# EAGLE design kilo (EAGLE 9.1.3)

## Sheet 1 of 2
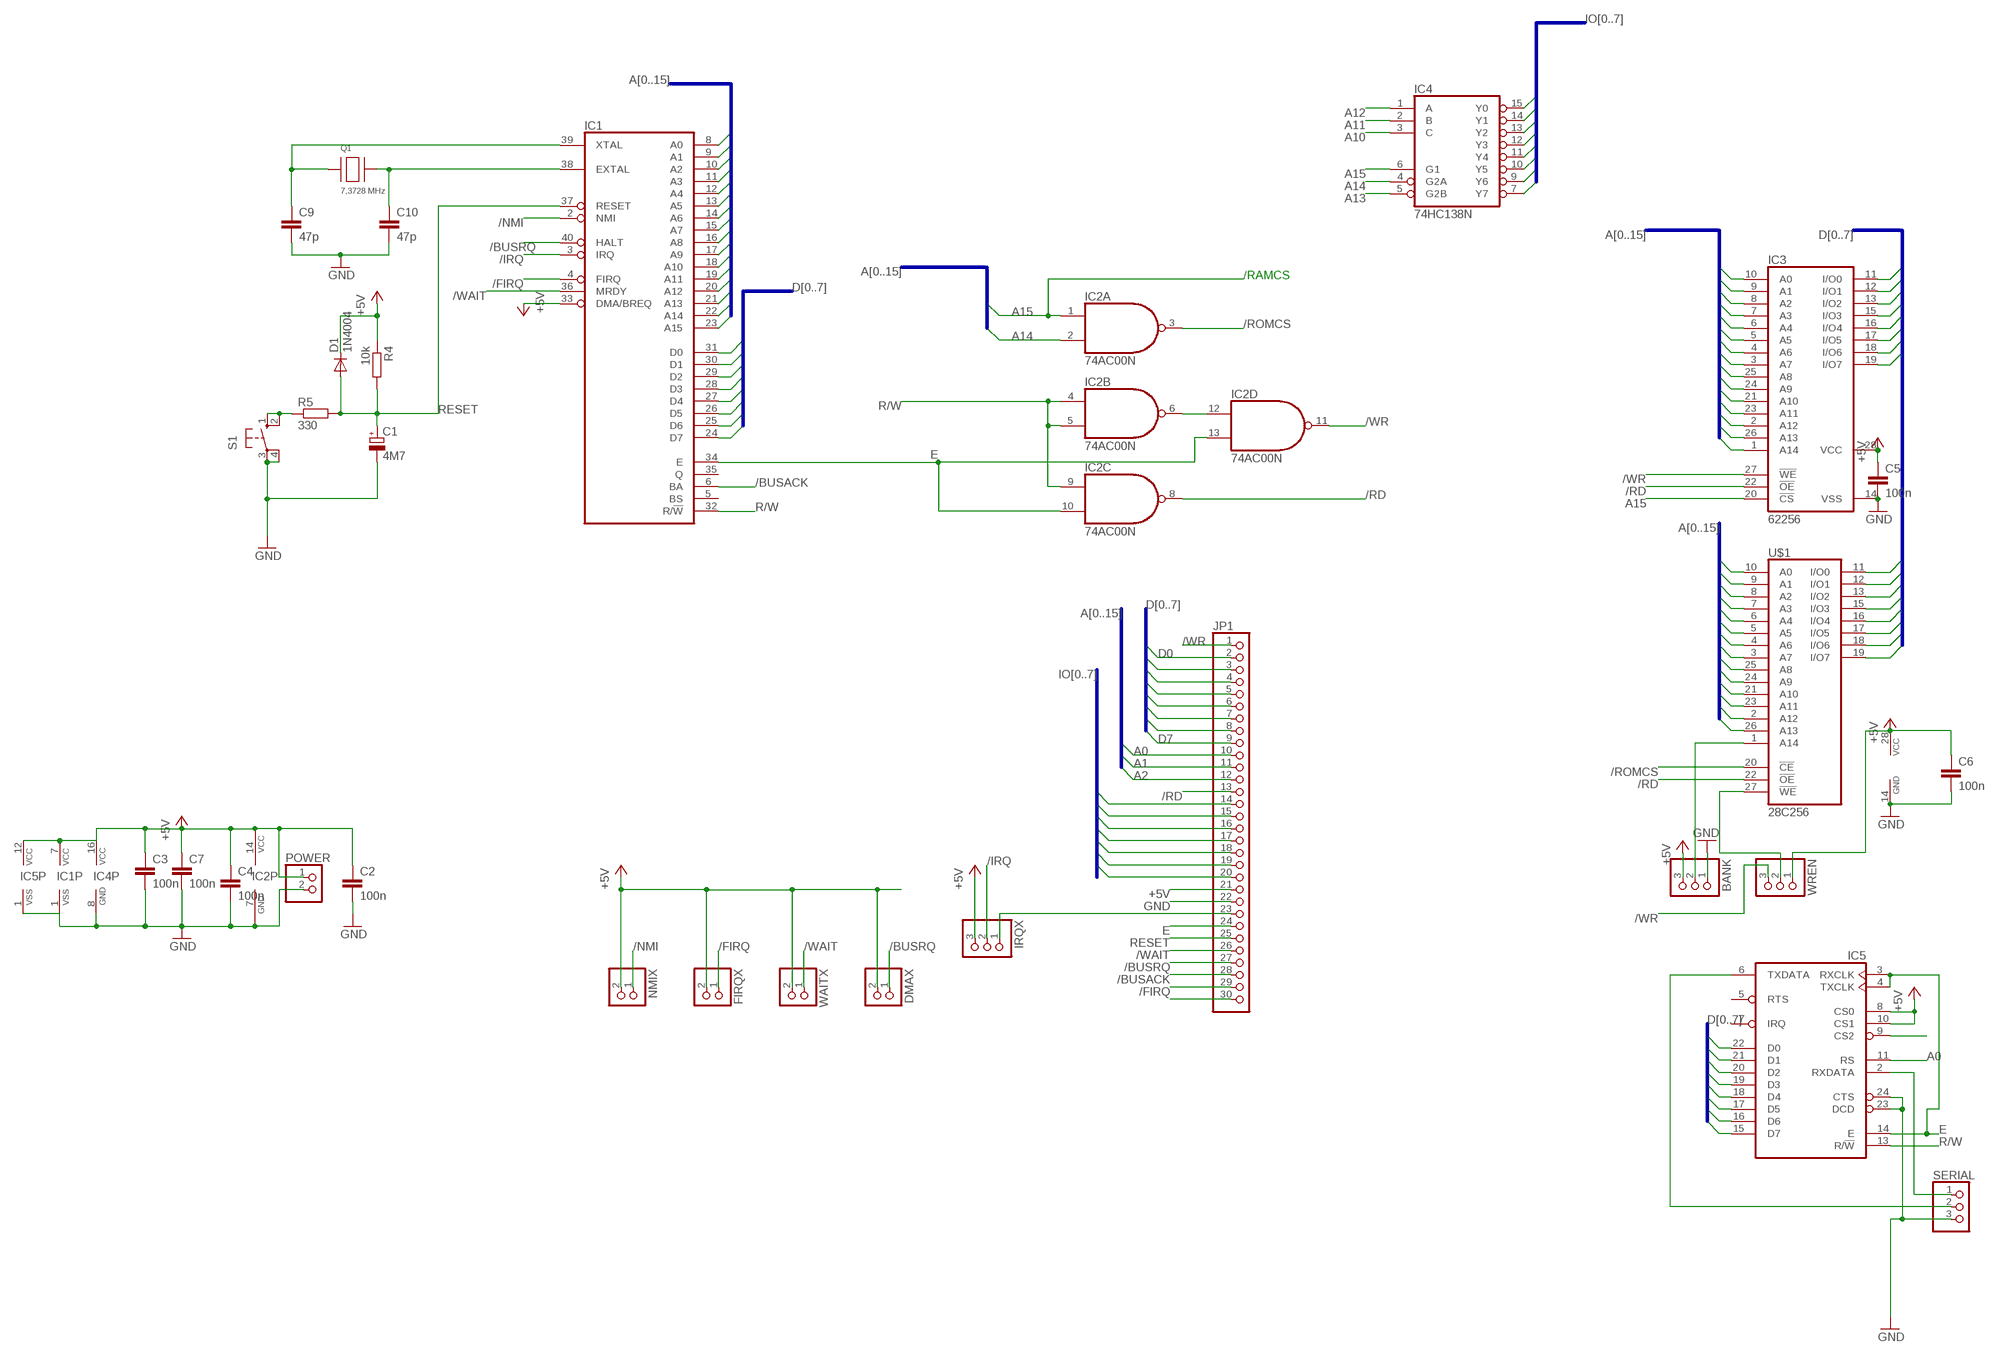
[diagram p0: schematic, sheet 1]

### Parts
BANK  PINHD-1X3  [1X03]
C1  4M7  CPOL-EUE2.5-6  [E2,5-6]
C2  100n  C-EU025-030X050  [C025-030X050]
C3  100n  C-EU025-030X050  [C025-030X050]
C4  100n  C-EU025-030X050  [C025-030X050]
C5  100n  C-EU025-030X050  [C025-030X050]
C6  100n  C-EU025-030X050  [C025-030X050]
C7  100n  C-EU025-030X050  [C025-030X050]
C9  47p  C-EU025-030X050  [C025-030X050]
C10  47p  C-EU025-030X050  [C025-030X050]
D1  1N4004  [DO41-10]
DMAX  PINHD-1X2  [1X02]
FIRQX  PINHD-1X2  [1X02]
IC1  6809  [DIL40]
IC2  74AC00N  74ALS00N  [DIL14]
IC3  62256  62256P  [DIL28-6]
IC4  74HC138N  [DIL16]
IC5  6850  [DIL24]
IRQX  PINHD-1X3  [1X03]
JP1  PINHD-1X30  [1X30]
NMIX  PINHD-1X2  [1X02]
POWER  PINHD-1X2  [1X02]
Q1  7,3728 MHz  306010080_XTAL_8MHZ_HC49US  [HC49US]
R4  10k  R-EU_0207/7  [0207/7]
R5  330  R-EU_0207/7  [0207/7]
S1  40-XX  [B3F-40XX]
SERIAL  PINHD-1X3  [1X03]
U$1  28C256  [DIL28]
WAITX  PINHD-1X2  [1X02]
WREN  PINHD-1X3  [1X03]

### Nets
+5V [supply]: BANK.3 C2.1 C3.1 C4.1 C5.1 C6.1 C7.1 D1.C DMAX.2 FIRQX.2 IC1.7(VCC) IC1.33(DMA/BREQ) IC2.14(P:VCC) IC3.28(VCC) IC4.16(VCC) IC5.8(CS0) IC5.10(CS1) IC5.12(VCC) IRQX.3 JP1.21 NMIX.2 POWER.1 R4.1 U$1.28(VCC) WAITX.2 WREN.1
/BUSACK: IC1.6(BA) JP1.28
/BUSRQ: DMAX.1 IC1.40(HALT) JP1.27
/FIRQ: FIRQX.1 IC1.4(FIRQ) JP1.29
/IRQ: IC1.3(IRQ) IRQX.2
/NMI: IC1.2(NMI) NMIX.1
/RD: IC2.8(C:O) IC3.22(!OE) JP1.13 U$1.22(!OE)
/ROMCS: IC2.3(A:O) U$1.20(!CE)
/WAIT: IC1.36(MRDY) JP1.26 WAITX.1
/WR: IC2.11(D:O) IC3.27(!WE) JP1.1 WREN.3
A0: IC1.8(A0) IC3.10(A0) IC5.11(RS) JP1.10 U$1.10(A0)
A1: IC1.9(A1) IC3.9(A1) JP1.11 U$1.9(A1)
A2: IC1.10(A2) IC3.8(A2) JP1.12 U$1.8(A2)
A3: IC1.11(A3) IC3.7(A3) U$1.7(A3)
A4: IC1.12(A4) IC3.6(A4) U$1.6(A4)
A5: IC1.13(A5) IC3.5(A5) U$1.5(A5)
A6: IC1.14(A6) IC3.4(A6) U$1.4(A6)
A7: IC1.15(A7) IC3.3(A7) U$1.3(A7)
A8: IC1.16(A8) IC3.25(A8) U$1.25(A8)
A9: IC1.17(A9) IC3.24(A9) U$1.24(A9)
A10: IC1.18(A10) IC3.21(A10) IC4.3(C) U$1.21(A10)
A11: IC1.19(A11) IC3.23(A11) IC4.2(B) U$1.23(A11)
A12: IC1.20(A12) IC3.2(A12) IC4.1(A) U$1.2(A12)
A13: IC1.21(A13) IC3.26(A13) IC4.5(G2B) U$1.26(A13)
A14: IC1.22(A14) IC2.2(A:I1) IC3.1(A14) IC4.4(G2A)
A15: IC1.23(A15) IC2.1(A:I0) IC3.20(!CS) IC4.6(G1)
D0: IC1.31(D0) IC3.11(I/O0) IC5.22(D0) JP1.2 U$1.11(I/O0)
D1: IC1.30(D1) IC3.12(I/O1) IC5.21(D1) JP1.3 U$1.12(I/O1)
D2: IC1.29(D2) IC3.13(I/O2) IC5.20(D2) JP1.4 U$1.13(I/O2)
D3: IC1.28(D3) IC3.15(I/O3) IC5.19(D3) JP1.5 U$1.15(I/O3)
D4: IC1.27(D4) IC3.16(I/O4) IC5.18(D4) JP1.6 U$1.16(I/O4)
D5: IC1.26(D5) IC3.17(I/O5) IC5.17(D5) JP1.7 U$1.17(I/O5)
D6: IC1.25(D6) IC3.18(I/O6) IC5.16(D6) JP1.8 U$1.18(I/O6)
D7: IC1.24(D7) IC3.19(I/O7) IC5.15(D7) JP1.9 U$1.19(I/O7)
E: IC1.34(E) IC2.10(C:I1) IC2.13(D:I1) IC5.3(RXCLK) IC5.4(TXCLK) IC5.14(E) JP1.24
GND [supply]: BANK.1 C1.- C2.2 C3.2 C4.2 C5.2 C6.2 C7.2 C9.2 C10.2 IC1.1(VSS) IC2.7(P:GND) IC3.14(VSS) IC4.8(GND) IC5.1(VSS) IC5.23(DCD) IC5.24(CTS) JP1.22 POWER.2 S1.3(P) S1.4(P1) SERIAL.3 U$1.14(GND)
IO0: IC4.15(Y0) IC5.9(CS2)
IO1: IC4.14(Y1) JP1.14
IO2: IC4.13(Y2) JP1.15
IO3: IC4.12(Y3) JP1.16
IO4: IC4.11(Y4) JP1.17
IO5: IC4.10(Y5) JP1.18
IO6: IC4.9(Y6) JP1.19
IO7: IC4.7(Y7) JP1.20
N$1: R5.1 S1.1(S) S1.2(S1)
N$8: JP1.30
N$9: BANK.2 U$1.1(A14)
N$10: IC2.6(B:O) IC2.12(D:I0)
N$31: U$1.27(!WE) WREN.2
N$32: IRQX.1 JP1.23
N$33: C10.1 IC1.38(EXTAL) Q1.P$2
N$35: IC5.2(RXDATA) SERIAL.1
N$36: IC5.6(TXDATA) SERIAL.2
PHI0: C9.1 IC1.39(XTAL) Q1.P$1
R/W: IC1.32(R/!W) IC2.4(B:I0) IC2.5(B:I1) IC2.9(C:I0) IC5.13(R/!W)
RESET: C1.+ D1.A IC1.37(RESET) JP1.25 R4.2 R5.2
Unconnected: IC1.5(BS) IC1.35(Q) IC5.5(RTS) IC5.7(IRQ)

### Buses
A[0..15]
D[0..7]
IO[0..7]

### Notes on the sheet
- /RAMCS

## Sheet 2 of 2

## Library data of the parts
BANK IRQX SERIAL WREN = pinhead:PINHD-1X3: PIN HEADER
C1 = rcl:CPOL-EU: POLARIZED CAPACITOR, European symbol
C2-C7 C9 C10 = rcl:C-EU: CAPACITOR, European symbol
D1 = adafruit:1N4004: DIODE General purpose 1N400x type rectifier (With bigger pads) http://www.ladyada.net/library/pcb/eaglelibrary.html
DMAX FIRQX NMIX POWER WAITX = pinhead:PINHD-1X2: PIN HEADER
IC1 = micro-motorola:6809: MICROCONTROLLER/MEMORY DEVICE; MF: NTE ELECTRONICS; MPN: NTE6809; OC_FARNELL: 4530354; OC_NEWARK: 31C2459
IC2 = 74xx-us:74*00: Quad 2-input NAND gate
IC3 = memory-hitachi:62256P: MEMORY; OC_FARNELL: unknown; OC_NEWARK: unknown
IC4 = 74xx-eu:74*138: 3-line to 8-line DECODER/DEMULTIPLEXER
IC5 = micro-motorola:6850: MICROCONTROLLER/MEMORY DEVICE; MF: NTE ELECTRONICS; MPN: NTE6850; OC_FARNELL: 4899775; OC_NEWARK: 31C2457
JP1 = pinhead:PINHD-1X30: PIN HEADER
Q1 = Seeed-OPL-2017-01-Crystal-Akita:306010080_XTAL_8MHZ_HC49US: HC49/US-11.35X4.65X3.6, DIP Crystal 8MHz-20pF-30ppm-80R, SKU: 306010080
R4 R5 = rcl:R-EU_: RESISTOR, European symbol
S1 = adafruit:40-XX: OMRON SWITCH; MF: OMRON COMPONENTS USA; MPN: B3F-4000; OC_FARNELL: 176434; OC_NEWARK: 36K3105
U$1 = memory:28C256: MEMORY

## Net classes
1 supply: width 0.61 mm

## Board
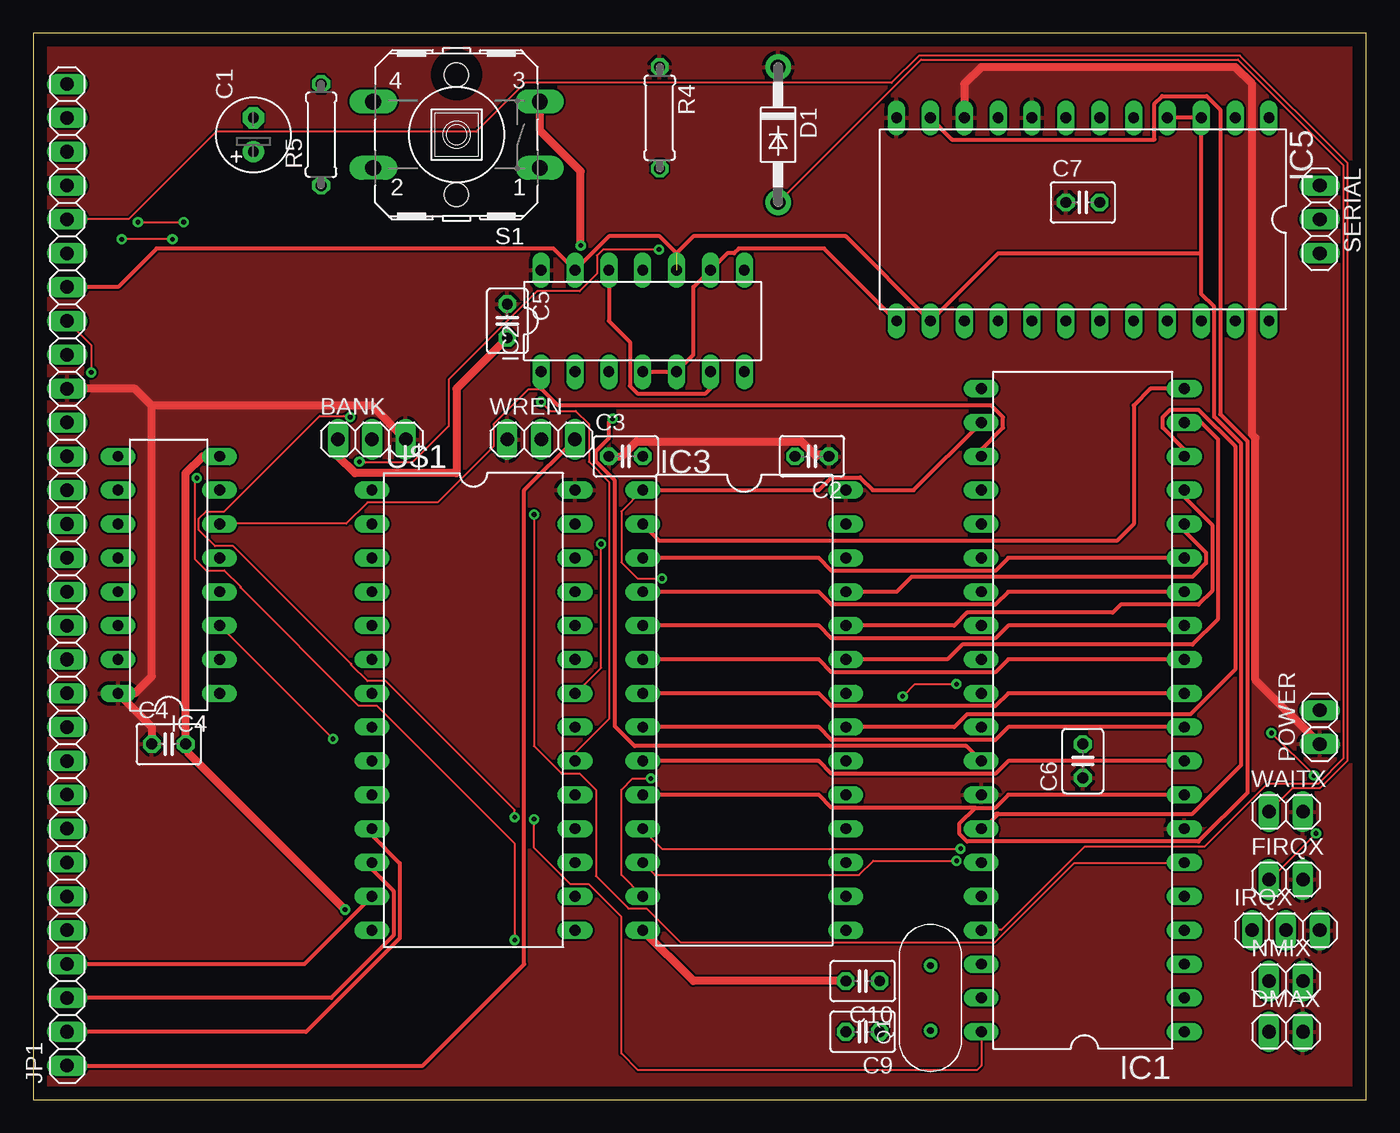
[diagram p1: board, top side]
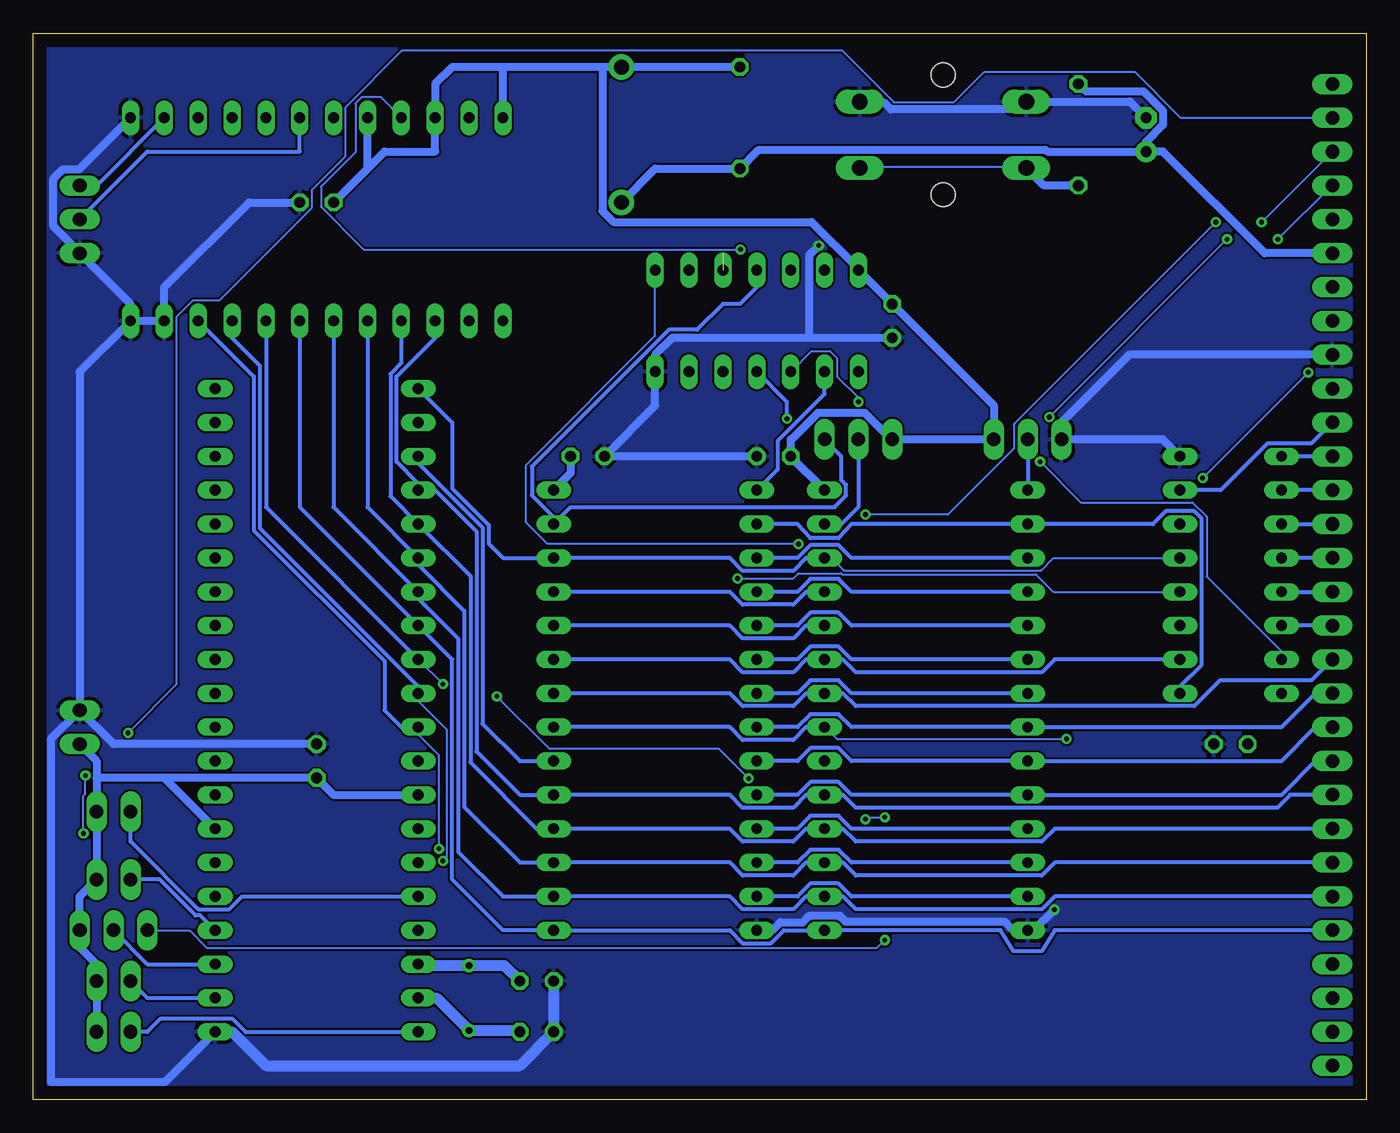
[diagram p2: board, bottom side, seen from below]

Size 100 x 80 mm. Coordinates in mm from the lower left corner, seen from the top.
Outline: 0,0 100,0 100,80 0,80 0,0
Copper layers (1*16): Top 0.035mm / dielectric 1.5mm / Bottom 0.035mm
Design rules "default": minimum track width 6mil, minimum drill 0.35mm, track to track 6mil, track to pad 6mil, pad to pad 6mil, via to via 6mil, smd to smd 6mil, copper to edge 40mil, drill to drill 6mil, minimum pad ring 10mil, minimum via ring 8mil, stop-mask expansion 4mil, vias tented up to drill 0mil, thermal gap 10mil

### Footprints (pad centres in the part's own frame; a part is rotated, then mirrored left to right if it is on the bottom)
1X03 = drill 1.016 long: 1 -2.54,0; 2 0,0; 3 2.54,0
E2,5-6 = drill 0.813 pad 1.6: + -1.27,0 | drill 0.813 pad 1.6 octagon: - 1.27,0
C025-030X050 = drill 0.813 octagon: 1 -1.27,0; 2 1.27,0
DO41-10 = drill 1.118 pad 1.93: A 5.08,0; C -5.08,0
1X02 = drill 1.016 long: 1 -1.27,0; 2 1.27,0
DIL40 = drill 0.813 long: 1 -24.13,-7.62; 2 -21.59,-7.62; 3 -19.05,-7.62; 4 -16.51,-7.62; 5 -13.97,-7.62; 6 -11.43,-7.62; 7 -8.89,-7.62; 8 -6.35,-7.62; 9 -3.81,-7.62; 10 -1.27,-7.62; 11 1.27,-7.62; 12 3.81,-7.62; 13 6.35,-7.62; 14 8.89,-7.62; 15 11.43,-7.62; 16 13.97,-7.62; 17 16.51,-7.62; 18 19.05,-7.62; 19 21.59,-7.62; 20 24.13,-7.62; 21 24.13,7.62; 22 21.59,7.62; 23 19.05,7.62; 24 16.51,7.62; 25 13.97,7.62; 26 11.43,7.62; 27 8.89,7.62; 28 6.35,7.62; 29 3.81,7.62; 30 1.27,7.62; 31 -1.27,7.62; 32 -3.81,7.62; 33 -6.35,7.62; 34 -8.89,7.62; 35 -11.43,7.62; 36 -13.97,7.62; 37 -16.51,7.62; 38 -19.05,7.62; 39 -21.59,7.62; 40 -24.13,7.62
DIL14 = drill 0.813 long: 1 -7.62,-3.81; 2 -5.08,-3.81; 3 -2.54,-3.81; 4 0,-3.81; 5 2.54,-3.81; 6 5.08,-3.81; 7 7.62,-3.81; 8 7.62,3.81; 9 5.08,3.81; 10 2.54,3.81; 11 0,3.81; 12 -2.54,3.81; 13 -5.08,3.81; 14 -7.62,3.81
DIL28-6 = drill 0.813 long: 1 -16.51,-7.62; 2 -13.97,-7.62; 3 -11.43,-7.62; 4 -8.89,-7.62; 5 -6.35,-7.62; 6 -3.81,-7.62; 7 -1.27,-7.62; 8 1.27,-7.62; 9 3.81,-7.62; 10 6.35,-7.62; 11 8.89,-7.62; 12 11.43,-7.62; 13 13.97,-7.62; 14 16.51,-7.62; 15 16.51,7.62; 16 13.97,7.62; 17 11.43,7.62; 18 8.89,7.62; 19 6.35,7.62; 20 3.81,7.62; 21 1.27,7.62; 22 -1.27,7.62; 23 -3.81,7.62; 24 -6.35,7.62; 25 -8.89,7.62; 26 -11.43,7.62; 27 -13.97,7.62; 28 -16.51,7.62
DIL16 = drill 0.813 long: 1 -8.89,-3.81; 2 -6.35,-3.81; 3 -3.81,-3.81; 4 -1.27,-3.81; 5 1.27,-3.81; 6 3.81,-3.81; 7 6.35,-3.81; 8 8.89,-3.81; 9 8.89,3.81; 10 6.35,3.81; 11 3.81,3.81; 12 1.27,3.81; 13 -1.27,3.81; 14 -3.81,3.81; 15 -6.35,3.81; 16 -8.89,3.81
DIL24 = drill 0.813 long: 1 -13.97,-7.62; 2 -11.43,-7.62; 3 -8.89,-7.62; 4 -6.35,-7.62; 5 -3.81,-7.62; 6 -1.27,-7.62; 7 1.27,-7.62; 8 3.81,-7.62; 9 6.35,-7.62; 10 8.89,-7.62; 11 11.43,-7.62; 12 13.97,-7.62; 13 13.97,7.62; 14 11.43,7.62; 15 8.89,7.62; 16 6.35,7.62; 17 3.81,7.62; 18 1.27,7.62; 19 -1.27,7.62; 20 -3.81,7.62; 21 -6.35,7.62; 22 -8.89,7.62; 23 -11.43,7.62; 24 -13.97,7.62
1X30 = drill 1.016 long: 1 -36.83,0; 2 -34.29,0; 3 -31.75,0; 4 -29.21,0; 5 -26.67,0; 6 -24.13,0; 7 -21.59,0; 8 -19.05,0; 9 -16.51,0; 10 -13.97,0; 11 -11.43,0; 12 -8.89,0; 13 -6.35,0; 14 -3.81,0; 15 -1.27,0; 16 1.27,0; 17 3.81,0; 18 6.35,0; 19 8.89,0; 20 11.43,0; 21 13.97,0; 22 16.51,0; 23 19.05,0; 24 21.59,0; 25 24.13,0; 26 26.67,0; 27 29.21,0; 28 31.75,0; 29 34.29,0; 30 36.83,0
HC49US = drill 0.5: P$1 -2.44,0; P$2 2.44,0
0207/7 = drill 0.813 octagon: 1 -3.81,0; 2 3.81,0
B3F-40XX = drill 1.194 long: 1 -6.248,2.489; 2 6.248,2.489; 3 -6.248,-2.489; 4 6.248,-2.489 | hole 1.803: 0,-4.496; 0,4.496
DIL28 = drill 0.813 long: 1 -16.51,-7.62; 2 -13.97,-7.62; 3 -11.43,-7.62; 4 -8.89,-7.62; 5 -6.35,-7.62; 6 -3.81,-7.62; 7 -1.27,-7.62; 8 1.27,-7.62; 9 3.81,-7.62; 10 6.35,-7.62; 11 8.89,-7.62; 12 11.43,-7.62; 13 13.97,-7.62; 14 16.51,-7.62; 15 16.51,7.62; 16 13.97,7.62; 17 11.43,7.62; 18 8.89,7.62; 19 6.35,7.62; 20 3.81,7.62; 21 1.27,7.62; 22 -1.27,7.62; 23 -3.81,7.62; 24 -6.35,7.62; 25 -8.89,7.62; 26 -11.43,7.62; 27 -13.97,7.62; 28 -16.51,7.62

### Placement (x,y rotation side)
BANK  25.4,49.53 0 top
C1  16.51,72.39 90 top
C2  58.42,48.26 180 top
C3  44.45,48.26 0 top
C4  10.16,26.67 0 top
C5  35.56,58.42 270 top
C6  78.74,25.4 90 top
C7  78.74,67.31 0 top
C9  62.23,5.08 180 top
C10  62.23,8.89 180 top
D1  55.88,72.39 270 top
DMAX  93.98,5.08 0 top
FIRQX  93.98,16.51 0 top
IC1  78.74,29.21 90 top
IC2  45.72,58.42 0 top
IC3  53.34,29.21 270 top
IC4  10.16,39.37 90 top
IC5  78.74,66.04 180 top
IRQX  93.98,12.7 0 top
JP1  2.54,39.37 90 top
NMIX  93.98,8.89 0 top
POWER  96.52,27.94 90 top
Q1  67.31,7.62 90 top
R4  46.99,73.66 270 top
R5  21.59,72.39 90 top
S1  31.75,72.39 180 top
SERIAL  96.52,66.04 270 top
U$1  33.02,29.21 270 top
WAITX  93.98,21.59 0 top
WREN  38.1,49.53 0 top

### Tracks (layer width: path | path; a pad name or v marks a point on that pad's centre or on a via)
+5V
  Top 0.61: 8.89,52.07 8.89,31.75 7.62,30.48 IC4.16 8.89,27.94 C4.1 | 8.89,52.07 7.62,53.34 JP1.21 | BANK.3 25.4,52.07 8.89,52.07 | POWER.1 91.69,31.5 91.69,49.65 91.44,49.9 91.44,76.2 90.17,77.47 71.12,77.47 69.85,76.2 IC5.10 | C3.1 44.14,48.26 45.26,49.38 57.61,49.38 58.58,48.41 | 58.58,48.41 58.73,48.26 | 58.58,48.41 59.53,48.41 C2.1
  Bottom 0.61: U$1.28 C3.1 43.18,49.53 43.13,49.53 41.15,51.51 37.59,51.51 35.61,49.53 WREN.1 BANK.3 27.94,52.07 C5.1 IC2.14 38.25,62.48 41.6,65.84 56.46,65.84 57.3,66.67 57.3,77.47 | IC3.28 59.69,46.99 C2.1 | DMAX.2 NMIX.2 95.25,10.16 96.52,11.43 IRQX.3 96.52,15.24 FIRQX.2 WAITX.2 95.25,24.13 | POWER.1 95.25,25.4 95.25,24.13 | 90.17,24.13 C6.1 77.47,22.86 IC1.33 | 90.17,24.13 95.25,24.13 | C7.1 74.93,69.85 | 74.93,69.85 IC5.8 | 74.93,69.85 73.66,71.12 69.85,71.12 IC5.10 69.85,76.2 68.58,77.47 64.77,77.47 | IC1.7 90.17,24.13 | R4.1 D1.C 57.3,77.47 | 57.3,77.47 64.77,77.47 | IC5.12 64.77,77.47
  pour Top: 0,80.01 100.33,80.01 100.33,0 0,0
/BUSACK  (via drill 0.35)
  Top 0.152: v37.57,43.89 37.57,26.52 39.62,24.46 41,24.46 42.22,23.24 42.22,16.76 44.65,14.33 46.02,14.33 48.54,11.81 72.16,11.81 78.11,17.75 86.33,17.75 IC1.6 | v7.85,65.84 v11.28,65.84
  Bottom 0.152: v37.57,43.89 31.39,43.89 26.44,48.84 26.44,50.67 v11.28,65.84 | v7.85,65.84 2.59,71.09 JP1.28
/BUSRQ  (via drill 0.35)
  Top 0.152: v10.44,64.54 v6.63,64.54 | v23.77,51.21 23.39,51.21 23.32,51.28 21.49,51.28 14.33,44.12 12.95,44.12 12.42,43.59 12.42,42.75 13.64,41.53 15.01,41.53 23.85,32.69 23.85,32.61 25.07,31.39 26.44,31.39 36.12,21.72 v36.12,21.18 | v37.57,21.03 37.57,18.9 40.31,16.15 41.68,16.15 44.12,13.72 44.12,3.45 45.36,2.21 70.79,2.21 71.12,2.54 IC1.40
  Bottom 0.152: v6.63,64.54 2.59,68.58 JP1.27 | v23.77,51.21 v10.44,64.54 | v36.12,21.18 37.41,21.18 v37.57,21.03
  Bottom 0.305: IC1.40 84.08,5.08 85.05,6.04 90.47,6.04 91.44,5.08 DMAX.1
/FIRQ  (via drill 0.35)
  Top 0.152: v96.09,24.31 v92.89,27.51 | v96.24,19.96 92.73,16.46 FIRQX.1
  Bottom 0.152: v92.89,27.51 89.23,31.17 89.23,58.75 88.01,59.97 86.03,59.97 79.1,66.9 79.1,68.28 76.58,70.79 76.58,74.45 72.31,78.72 39.32,78.72 35.43,74.83 30.94,74.83 28.65,77.11 17.37,77.11 13.95,73.69 2.59,73.69 JP1.29 | v96.09,24.31 96.09,22.94 96.24,22.78 v96.24,19.96
  Bottom 0.305: IC1.4 87.48,13.82 87.82,13.82 90.51,16.51 FIRQX.1
/IRQ
  Bottom 0.305: IC1.3 91.44,10.16 IRQX.2
/NMI
  Bottom 0.305: IC1.2 91.44,7.62 NMIX.1
/RD  (via drill 0.35)
  Top 0.152: v42.6,41.68 42.6,32.38 40.69,30.48 U$1.22
  Bottom 0.152: IC2.8 53.34,57.3 63.02,47.62 63.02,43.28 61.42,41.68 v42.6,41.68
  Bottom 0.305: IC3.22 47.74,30.48 46.78,29.52 42.98,29.52 42.02,30.48 U$1.22 39.26,30.48 38.3,29.52 12.91,29.52 10.98,31.45 4.12,31.45 JP1.13
/ROMCS  (via drill 0.35)
  Top 0.152: v38.1,52.35 38.79,51.66 40.69,51.66 41.68,50.67 41.68,47.85 43.2,46.33 43.2,28.57 40.69,26.06 40.69,25.45 U$1.20
  Bottom 0.152: v38.1,52.35 38.1,52.65 39.7,54.25 39.7,55.63 40.23,56.16 41.6,56.16 43.13,54.63 IC2.3
/WAIT
  Top 0.152: JP1.26 2.59,66.06 7.16,66.06 13.72,72.62 33.22,72.62 36.88,76.28 64.39,76.28 66.45,78.33 90.53,78.33 98.6,70.26 98.6,25.45 96.55,23.39 94.49,23.39 92.73,21.64 WAITX.1
  Bottom 0.305: IC1.36 84.33,15.24 85.3,14.28 87.63,14.28 92.71,19.36 WAITX.1
/WR
  Top 0.305: JP1.1 29.21,2.54 36.83,10.16 36.83,45.72 WREN.3
  Bottom 0.305: WREN.3 39.37,48.26 39.37,46.48 39.01,46.12 39.01,45.32 39.88,44.45 59.69,44.45 IC3.27 60.96,43.7 62.59,45.32 62.59,47.5 52.32,57.76 50.19,57.76 48.26,59.69 46.99,59.69 45.72,60.96 IC2.11
A0
  Top 0.305: IC1.8 73.14,22.86 72.18,21.89 70.67,21.89 | IC3.10 58.94,22.86 59.9,21.89 70.67,21.89 | IC5.11 68.94,72.03 84.12,72.03 84.12,74.72 84.69,75.29 88.03,75.29 89.05,74.26 89.05,51.43 91.08,49.39 91.08,23.02 87.42,19.36 70.06,19.36 69.49,19.92 69.49,20.72 70.67,21.89
  Bottom 0.305: IC3.10 42.66,22.86 41.7,23.82 39.58,23.82 38.62,22.86 U$1.10 6.35,22.86 3.81,25.4 JP1.10
A1
  Top 0.305: IC1.9 73.14,25.4 72.18,24.43 59.9,24.43 58.94,25.4 IC3.9
  Bottom 0.305: IC3.9 42.66,25.4 41.7,26.36 39.58,26.36 38.62,25.4 U$1.9 6.35,25.4 3.81,27.94 JP1.11
A2
  Top 0.305: IC1.10 73.14,27.94 72.18,26.98 59.9,26.98 58.94,27.94 IC3.8
  Bottom 0.305: IC3.8 42.66,27.94 41.7,28.91 39.58,28.91 38.62,27.94 U$1.8 6.35,27.94 3.81,30.48 JP1.12
A3
  Top 0.305: IC1.11 73.14,30.48 72.18,29.52 59.9,29.52 58.94,30.48 IC3.7
  Bottom 0.305: U$1.7 38.62,30.48 39.58,31.45 41.7,31.45 42.66,30.48 IC3.7
A4
  Top 0.305: IC1.12 73.14,33.02 72.18,32.05 59.9,32.05 58.94,33.02 IC3.6
  Bottom 0.305: U$1.6 38.62,33.02 39.58,33.98 41.7,33.98 42.66,33.02 IC3.6
A5
  Top 0.305: IC1.13 73.14,35.56 72.18,34.59 59.9,34.59 58.94,35.56 IC3.5
  Bottom 0.305: U$1.5 38.62,35.56 39.58,36.52 41.7,36.52 42.66,35.56 IC3.5
A6
  Top 0.305: IC1.14 73.14,38.1 72.18,37.13 59.9,37.13 58.94,38.1 IC3.4
  Bottom 0.305: U$1.4 38.62,38.1 39.58,39.06 41.7,39.06 42.66,38.1 IC3.4
A7
  Top 0.305: IC1.15 73.14,40.64 72.18,39.67 59.9,39.67 58.94,40.64 IC3.3
  Bottom 0.305: U$1.3 38.62,40.64 39.58,41.6 41.7,41.6 42.66,40.64 IC3.3
A8
  Top 0.305: IC1.16 86.36,42.66 87.99,41.04 87.99,40.24 86.96,39.22 65.89,39.22 64.77,38.1 IC3.25
  Bottom 0.305: U$1.25 42.02,38.1 42.98,37.13 46.78,37.13 47.74,38.1 IC3.25
A9
  Top 0.305: IC1.17 86.36,45.2 88.44,43.12 88.44,38.16 87.42,37.13 81.58,37.13 80.97,36.52 70.06,36.52 69.09,35.56 IC3.24
  Bottom 0.305: U$1.24 42.02,35.56 42.98,34.59 46.78,34.59 47.74,35.56 IC3.24
A10  (via drill 0.35)
  Top 0.152: v22.48,27.05 IC4.3
  Top 0.305: IC1.18 86.36,48.77 84.73,50.4 84.73,51.2 85.3,51.77 87.42,51.77 90.17,49.02 90.17,32.27 86.81,28.91 70.06,28.91 69.09,27.94 IC3.21
  Bottom 0.152: v22.48,27.05 39.7,27.05 40.54,27.89 U$1.21
  Bottom 0.305: U$1.21 42.02,27.94 42.98,26.98 46.78,26.98 47.74,27.94 IC3.21
A11
  Top 0.305: IC3.23 68.58,33.02 69.7,34.14 86.96,34.14 88.9,36.08 88.9,49.53 87.63,50.8 IC1.19
  Bottom 0.305: IC3.23 47.74,33.02 46.78,32.05 42.98,32.05 42.02,33.02 U$1.23 39.26,33.02 38.3,32.05 24.34,32.05 23.38,33.02 IC4.2
A12
  Top 0.305: IC3.2 46.99,41.91 81.28,41.91 82.55,43.18 82.55,52.07 83.82,53.34 IC1.20
  Bottom 0.305: IC3.2 42.66,43.18 41.7,42.11 39.58,42.11 38.62,43.18 U$1.2 15.99,43.18 15.03,44.15 12.91,44.15 12.34,43.58 12.34,32.62 13.97,31 IC4.1
A13
  Bottom 0.152: IC4.5 14.02,40.62 23.47,40.62 24.38,39.7 39.17,39.7 40.01,40.54 40.54,40.54 U$1.26
  Bottom 0.305: U$1.26 42.02,40.64 42.98,39.67 46.78,39.67 47.74,40.64 IC3.26 64.77,40.64 65.84,41.71 65.84,43.11 68.58,45.85 68.58,50.8 IC1.21
A14  (via drill 0.35)
  Top 0.152: v47.17,39.09 45.34,39.09 44.12,40.31 44.12,44.12 IC3.1
  Top 0.305: IC1.22 66.04,45.72 62.98,45.72 62.02,46.69 59.9,46.69 58.94,45.72 IC3.1
  Bottom 0.152: IC4.4 23.47,38.1 24.77,39.4 39.32,39.4 39.4,39.47 42.6,39.47 42.98,39.09 v47.17,39.09
  Bottom 0.305: IC3.1 44.15,47.3 44.15,49.43 40.64,52.93 IC2.2
A15
  Top 0.152: IC4.6 14.02,43.2 23.47,43.2 25.07,44.81 30.33,44.81 34.52,49 34.52,50.67 37.11,53.26 38.02,53.26 38.1,53.34
  Top 0.305: IC1.23 71.12,48.77 72.75,50.4 72.75,51.2 71.88,52.07 39.37,52.07 38.1,53.34 IC2.1
  Bottom 0.305: IC1.23 71.12,47.74 66.29,42.92 66.29,28.19 63.5,25.4 IC3.20
D0  (via drill 0.35)
  Top 0.152: v69.57,18.82 47.17,18.82 45.72,20.27 IC3.11
  Top 0.305: U$1.11 25.4,19.8 27.48,17.72 27.48,12.11 20.45,5.08 JP1.2
  Bottom 0.152: v69.57,18.82 69.57,25.83 71.09,27.36 71.09,27.81 IC1.31
  Bottom 0.305: U$1.11 38.62,20.32 39.58,21.29 41.7,21.29 42.66,20.32 IC3.11 | IC5.22 83.46,54.25 83.46,42.69 73.66,32.89 73.66,29.21 72.39,27.94 IC1.31
D1  (via drill 0.35)
  Top 0.152: v69.27,17.91 63.02,17.91 61.95,16.84 46.63,16.84 45.72,17.75 IC3.12
  Top 0.305: U$1.12 25.4,17.27 27.03,15.64 27.03,12.3 22.34,7.62 JP1.3
  Bottom 0.152: v69.27,17.91 68.96,18.21 68.96,27.74 71.02,29.79 71.02,30.4 IC1.30
  Bottom 0.305: U$1.12 38.62,17.78 39.58,18.75 41.7,18.75 42.66,17.78 IC3.12 | IC5.21 85.09,57.15 83.01,55.07 83.01,42.88 71.12,31 IC1.30
D2  (via drill 0.35)
  Top 0.152: v69.27,31.17 66.14,31.17 v65.23,30.25 | v46.33,24.08 44.96,24.08 44.12,23.24 44.12,16.84 IC3.13
  Top 0.305: U$1.13 20.32,10.16 JP1.4
  Bottom 0.152: v69.27,31.17 IC1.29 | v65.23,30.25 61.27,26.29 48.54,26.29 v46.33,24.08
  Bottom 0.305: U$1.13 38.62,15.24 39.58,16.2 41.7,16.2 42.66,15.24 IC3.13 | IC5.20 82.55,44.45 IC1.29
D3
  Bottom 0.305: JP1.5 23.38,12.7 24.34,11.12 26.46,11.12 27.43,12.7 U$1.15 43.7,12.7 44.66,11.73 46.78,11.73 47.74,12.7 IC3.15 64.77,12.7 68.58,16.51 68.58,33.02 IC1.28 80.01,44.45 IC5.19
D4
  Bottom 0.305: JP1.6 23.38,15.24 24.34,14.28 38.3,14.28 39.26,15.24 U$1.16 42.02,15.24 42.98,14.28 46.78,14.28 47.74,15.24 IC3.16 64.77,15.24 68.12,18.59 68.12,34.59 71.12,37.59 IC1.27 77.47,44.45 IC5.18
D5
  Bottom 0.305: JP1.7 23.38,17.78 24.34,16.82 38.3,16.82 39.26,17.78 U$1.17 42.02,17.78 42.98,16.82 46.78,16.82 47.74,17.78 IC3.17 63.5,17.78 67.67,21.95 67.67,36.67 71.12,40.12 IC1.26 74.93,44.45 IC5.17
D6
  Bottom 0.305: JP1.8 23.38,20.32 24.34,19.36 38.3,19.36 39.26,20.32 U$1.18 42.02,20.32 42.98,19.36 46.78,19.36 47.74,20.32 IC3.18 62.23,20.32 67.21,25.3 67.21,39.27 IC1.25 73.2,45.26 73.2,54.44 72.39,55.26 IC5.16
D7
  Bottom 0.305: JP1.9 5.7,22.86 6.67,21.89 38.3,21.89 39.26,22.86 U$1.19 42.02,22.86 42.98,21.89 46.78,21.89 47.74,22.86 IC3.19 63.5,22.86 66.75,26.11 66.75,42.62 69.85,45.72 IC1.24 71.12,46.23 72.75,47.86 72.75,54.25 69.85,57.15 IC5.15
E  (1 unrouted)
  Top 0.305: 87.63,63.5 87.63,60.45 88.59,59.48 88.59,51.24 90.63,49.2 90.63,25.1 86.96,21.44 72.39,21.44 | 87.63,63.5 IC5.3 IC5.4 | 72.24,21.44 72.39,21.44 | 87.63,63.5 72.39,63.5 IC5.14 60.96,64.77 49.53,64.77 48.26,63.5 46.99,64.77 43.18,64.77 IC2.13 39.01,63.86 9.25,63.86 6.35,60.96 JP1.24 | IC1.34 71.27,20.32 72.39,21.44
GND  (via drill 0.35)
  Top 0.61: C10.2 49.53,8.89 IC3.14 | IC4.8 12.7,48.26 11.43,46.99 C4.2 11.58,26.44 11.58,26.06 v23.39,14.25 | C5.2 31.75,53.34 31.75,46.99 24.13,46.99 22.86,48.26 BANK.1 | v41.07,64.08 41.07,69.65 38.02,72.69 38.02,74.83 S1.3
  Bottom 0.61: C3.2 C2.2 53.34,52.07 IC2.7 53.34,55.88 52.07,57.15 41.76,57.15 | IC4.8 15.24,49.53 BANK.1 22.86,50.8 17.78,55.88 JP1.22 | IC5.24 IC5.23 90.17,60.96 83.82,67.31 C7.2 | IC5.24 92.71,59.69 SERIAL.3 96.52,63.55 98.5,65.53 98.5,69.08 97.79,69.8 96.57,69.8 IC5.1 | C6.2 93.98,26.67 POWER.2 | IC5.24 96.52,54.61 POWER.2 | POWER.2 98.68,27.05 98.68,1.32 90.12,1.32 IC1.1 | C1.- 17.73,74.88 S1.4 25.76,74.75 26.21,74.3 35.66,74.3 36.2,74.83 37.95,74.83 S1.3 | IC3.14 44.56,12.7 43.95,13.31 42.27,13.31 41.76,13.82 39.52,13.82 39.05,13.35 27.16,13.35 26.5,12.7 U$1.14 25.15,12.8 24.84,12.8 v23.39,14.25 | C5.2 41.76,57.15 | v41.07,64.08 41.76,63.4 41.76,57.15
  Bottom 0.813: C10.2 C9.2 63.5,2.54 82.55,2.54 85.09,5.08 IC1.1
  pour Bottom: 0,80.01 100.33,80.01 100.33,0 0,0
IO0  (via drill 0.35)
  Top 0.152: v24.46,47.85 24.84,47.85 24.92,47.78 28.42,47.78 31.17,50.52 31.17,54.03 37.8,60.66 41,60.66 42.29,61.95 42.29,63.32 42.75,63.78 v46.94,63.78
  Bottom 0.152: v24.46,47.85 21.41,44.81 13.03,44.81 11.96,43.74 11.96,39.24 6.4,33.68 6.4,33.07 IC4.15 | v46.94,63.78 75.21,63.78 78.41,66.98 78.41,68.5 75.82,71.09 75.82,74.75 75.36,75.21 73.91,75.21 72.39,73.69 IC5.9
IO1
  Bottom 0.305: JP1.14 IC4.14
IO2
  Bottom 0.305: IC4.13 JP1.15
IO3
  Bottom 0.305: JP1.16 IC4.12
IO4
  Bottom 0.305: IC4.11 JP1.17
IO5
  Bottom 0.305: JP1.18 IC4.10
IO6
  Bottom 0.305: JP1.19 IC4.9
IO7
  Bottom 0.305: JP1.20 4.12,49.23 7.41,49.23 10.91,45.72 IC4.7
N$1
  Bottom 0.152: S1.1 37.95,69.95 25.76,69.95 S1.2
  Bottom 0.61: R5.1 24.18,68.58 S1.2
N$9
  Bottom 0.305: BANK.2 U$1.1
N$10
  Top 0.305: IC2.12 43.18,58.42 44.76,56.84 44.76,53.55 45.32,52.98 50.44,52.98 50.8,53.34 IC2.6
N$31
  Bottom 0.305: WREN.2 38.1,44.45 39.37,43.18 U$1.27
N$32  (via drill 0.35)
  Top 0.152: v36.12,11.96 36.12,19.2 25.76,29.57 24.38,29.57 15.54,38.41 15.54,38.48 14.33,39.7 12.95,39.7 12.12,40.54 12.12,46.48 v12.27,46.63 | v4.34,54.56 4.34,56.62 JP1.23
  Bottom 0.152: v36.12,11.96 36.73,11.35 86.94,11.35 88.24,12.65 91.44,12.65 IRQX.1 | v4.34,54.56 v12.27,46.63
N$33
  Bottom 0.813: IC1.38 71.02,10.06 Q1.P$2 64.67,10.06 C10.1
N$35
  Bottom 0.305: IC5.2 95.25,68.58 SERIAL.1
N$36
  Bottom 0.305: SERIAL.2 91.44,71.12 80.01,71.12 IC5.6
PHI0
  Bottom 0.813: IC1.39 69.75,7.62 Q1.P$1 63.6,5.18 C9.1
R/W  (via drill 0.35)
  Top 0.305: IC2.4 IC2.5 49.53,55.88 49.53,60.96 IC2.9 52.07,63.5 52.59,63.5 52.94,63.86 59.33,63.86 IC5.13 | IC1.32 70,26.52 45.12,26.52 43.64,28 43.64,46.44 42.22,47.86 42.22,48.66 43.18,49.62 43.18,50.8 v43.46,51.08
  Bottom 0.305: v43.46,51.08 43.46,52.35 IC2.4
RESET
  Top 0.152: D1.A 66.6,78.03 90.37,78.03 98.3,70.1 98.3,25.6 96.39,23.7 92.58,23.7 87.86,18.97 78.87,18.97 72.62,12.72 71.17,12.72 IC1.37
  Bottom 0.61: R5.2 21.03,75.64 16.71,75.64 15.25,74.18 15.25,73.14 16.51,71.88 C1.+ | JP1.25 7.62,63.5 15.24,71.12 C1.+ | D1.A 53.34,69.85 R4.2 45.59,71.25 24.05,71.25 23.91,71.12 C1.+